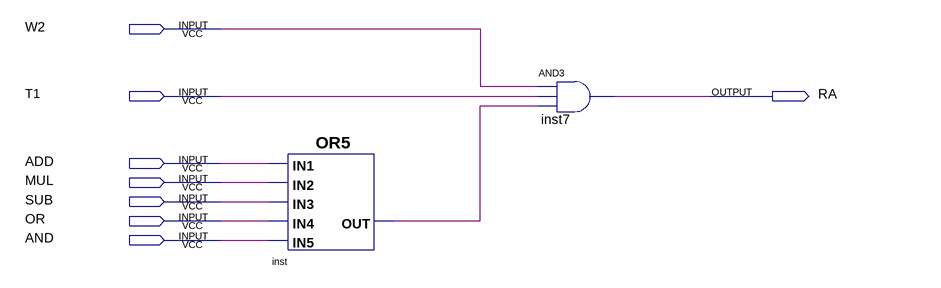
[diagram p0: schematic sheet]
// Quartus schematic RA.bdf as structural Verilog: 2 symbols, 8 pins
module RA (
  input  W2,
  input  T1,
  input  ADD,
  input  MUL,
  input  SUB,
  input  OR,
  input  AND,
  output RA
);

  wire inst_out;

  or inst (inst_out, ADD, MUL, SUB, OR, AND);
  and inst7 (RA, W2, T1, inst_out);
endmodule
